# Altium schematic sheet Cover Page.SchDoc
size A4; SheetNumber: 1; SheetTotal: 6
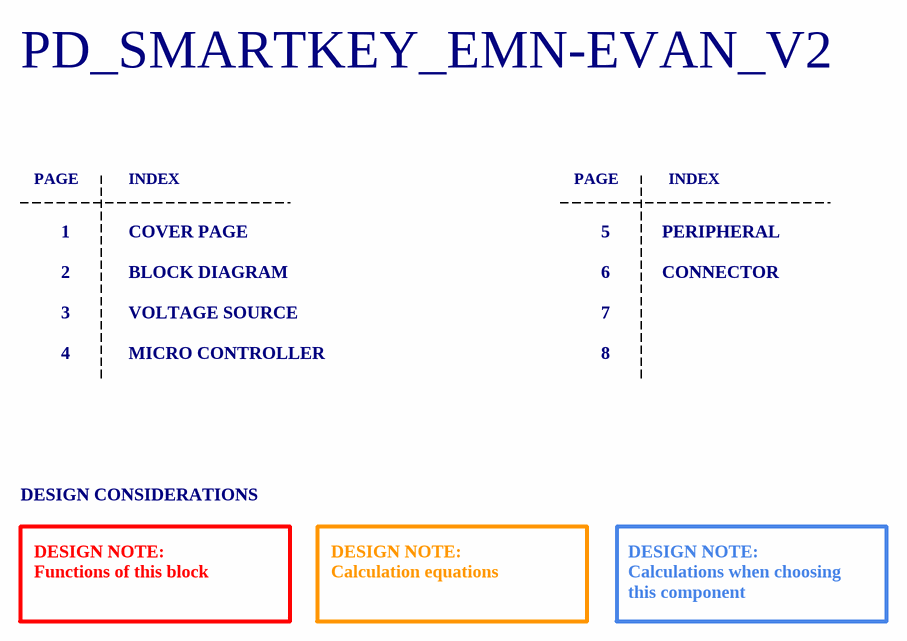
[diagram p0: Cover Page.SchDoc]

## Notes on the sheet
- PD_SMARTKEY_EMN-EVAN_V2
- PAGE
- INDEX
- 1
- 2
- COVER PAGE
- BLOCK DIAGRAM
- 5
- 6
- PERIPHERAL
- CONNECTOR
- 3
- 4
- VOLTAGE SOURCE
- MICRO CONTROLLER
- 7
- 8
- DESIGN CONSIDERATIONS
- DESIGN NOTE:
  Functions of this block
- DESIGN NOTE:
  Calculation equations
- DESIGN NOTE:
  Calculations when choosing this component
- Author:
- Title:
- Size:
- A4
- Project:
- Approved:
- Revision:
- Modified Date:
- CONFIDENTIAL
- Date:
- SW Version: